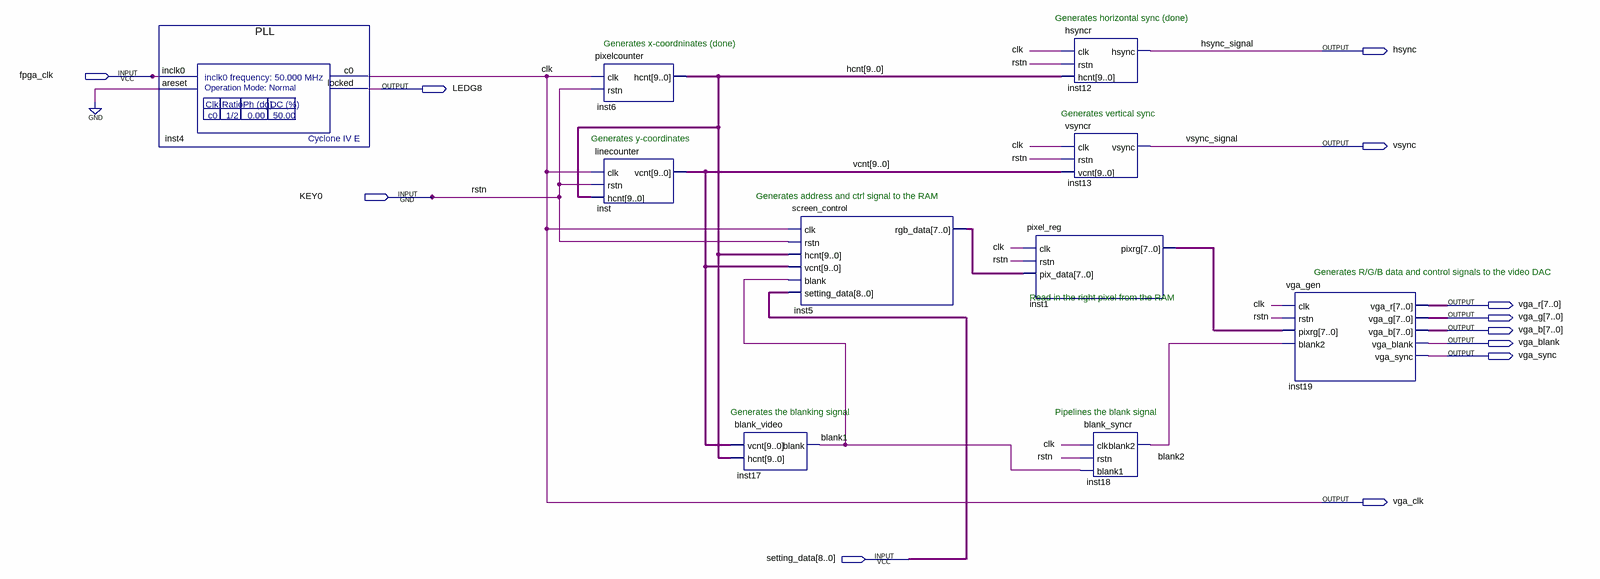
[diagram p0: schematic sheet]
// Quartus schematic VGA_contr.bdf as structural Verilog: 10 symbols, 12 pins
module VGA_contr (
  input  fpga_clk,
  input  KEY0,
  input  [8:0] setting_data,
  output hsync,
  output LEDG8,
  output vsync,
  output [7:0] vga_r,
  output [7:0] vga_g,
  output [7:0] vga_b,
  output vga_blank,
  output vga_sync,
  output vga_clk
);

  wire blank1, blank2;
  wire [7:0] inst1_pixrg, inst5_rgb_data;
  wire [9:0] hcnt, vcnt;

  PLL inst4 (.inclk0(fpga_clk), .areset(1'b0), .c0(vga_clk), .locked(LEDG8));
  pixelcounter inst6 (.clk(vga_clk), .rstn(KEY0), .hcnt(hcnt));
  linecounter inst (.clk(vga_clk), .hcnt(hcnt), .rstn(KEY0), .vcnt(vcnt));
  blank_video inst17 (.vcnt(vcnt), .hcnt(hcnt), .blank(blank1));
  screen_control inst5 (
    .clk(vga_clk), .rstn(KEY0), .hcnt(hcnt), .vcnt(vcnt), .blank(blank1), .setting_data(setting_data),
    .rgb_data(inst5_rgb_data));
  pixel_reg inst1 (.clk(vga_clk), .rstn(KEY0), .pix_data(inst5_rgb_data), .pixrg(inst1_pixrg));
  hsyncr inst12 (.clk(vga_clk), .hcnt(hcnt), .rstn(KEY0), .hsync(hsync));
  vsyncr inst13 (.clk(vga_clk), .vcnt(vcnt), .rstn(KEY0), .vsync(vsync));
  blank_syncr inst18 (.clk(vga_clk), .rstn(KEY0), .blank1(blank1), .blank2(blank2));
  vga_gen inst19 (
    .clk(vga_clk), .rstn(KEY0), .pixrg(inst1_pixrg), .blank2(blank2), .vga_r(vga_r), .vga_g(vga_g),
    .vga_b(vga_b), .vga_blank(vga_blank), .vga_sync(vga_sync));

  // Other names for the same wires on the sheet: clk = vga_clk; hsync_signal = hsync; rstn = KEY0;
  //   vsync_signal = vsync

  // Notes on the sheet:
  //   Generates horizontal sync (done)
  //   Generates x-coordninates (done)
  //   Generates vertical sync
  //   Generates y-coordinates
  //   Generates address and ctrl signal to the RAM
  //   Generates R/G/B data and control signals to the video DAC
  //   Read in the right pixel from the RAM
  //   Generates the blanking signal
  //   Pipelines the blank signal
endmodule
